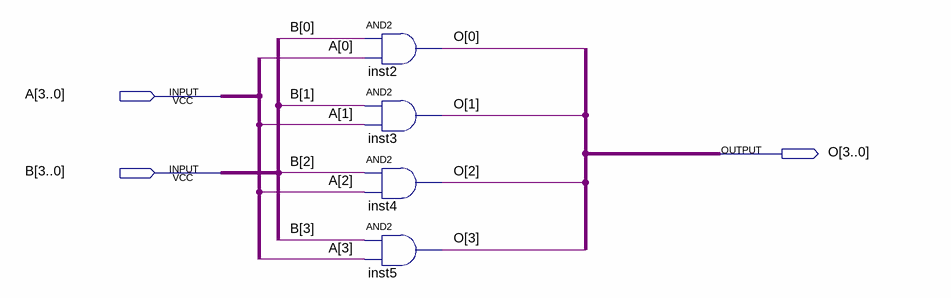
[diagram p0: schematic sheet]
// Quartus schematic fourbitand.bdf as structural Verilog: 4 symbols, 3 pins
module fourbitand (
  input  [3:0] A,
  input  [3:0] B,
  output [3:0] O
);

  and inst2 (O[0], B[0], A[0]);
  and inst3 (O[1], B[1], A[1]);
  and inst4 (O[2], B[2], A[2]);
  and inst5 (O[3], B[3], A[3]);
endmodule
